# EAGLE schematic tunable_laser_controller (EAGLE 9.2.2)
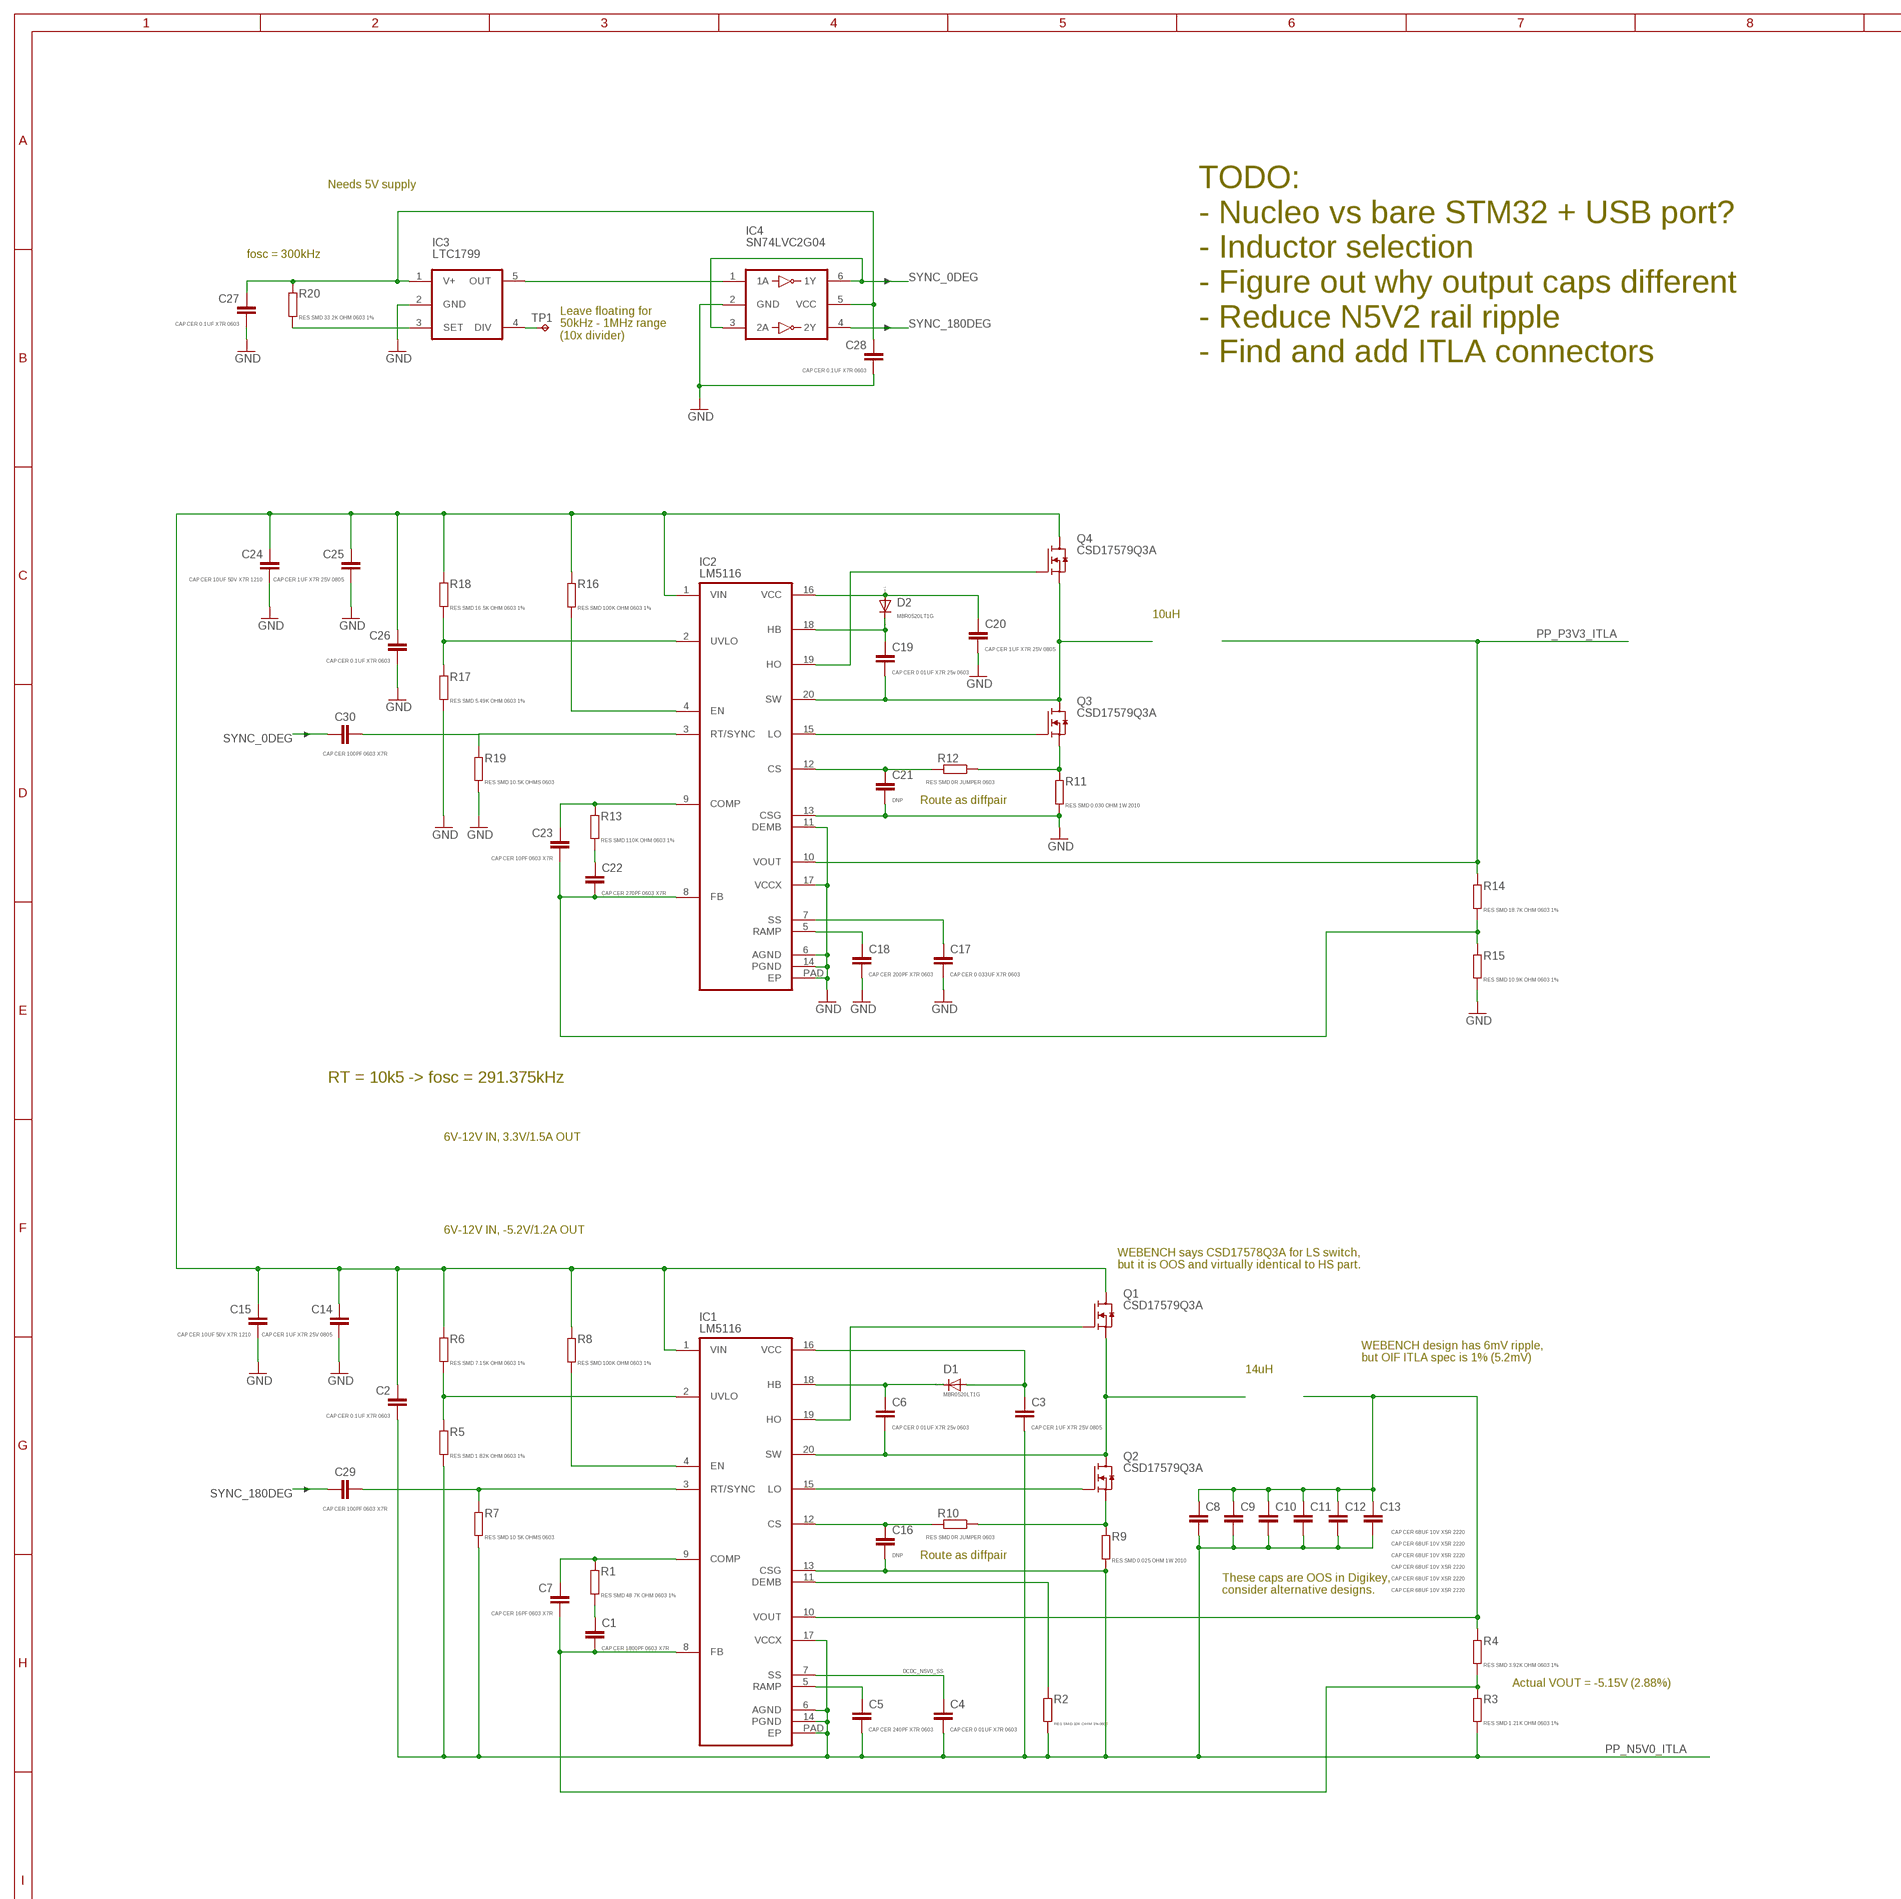
[diagram p0: schematic, sheet 1, part 1 of 2]
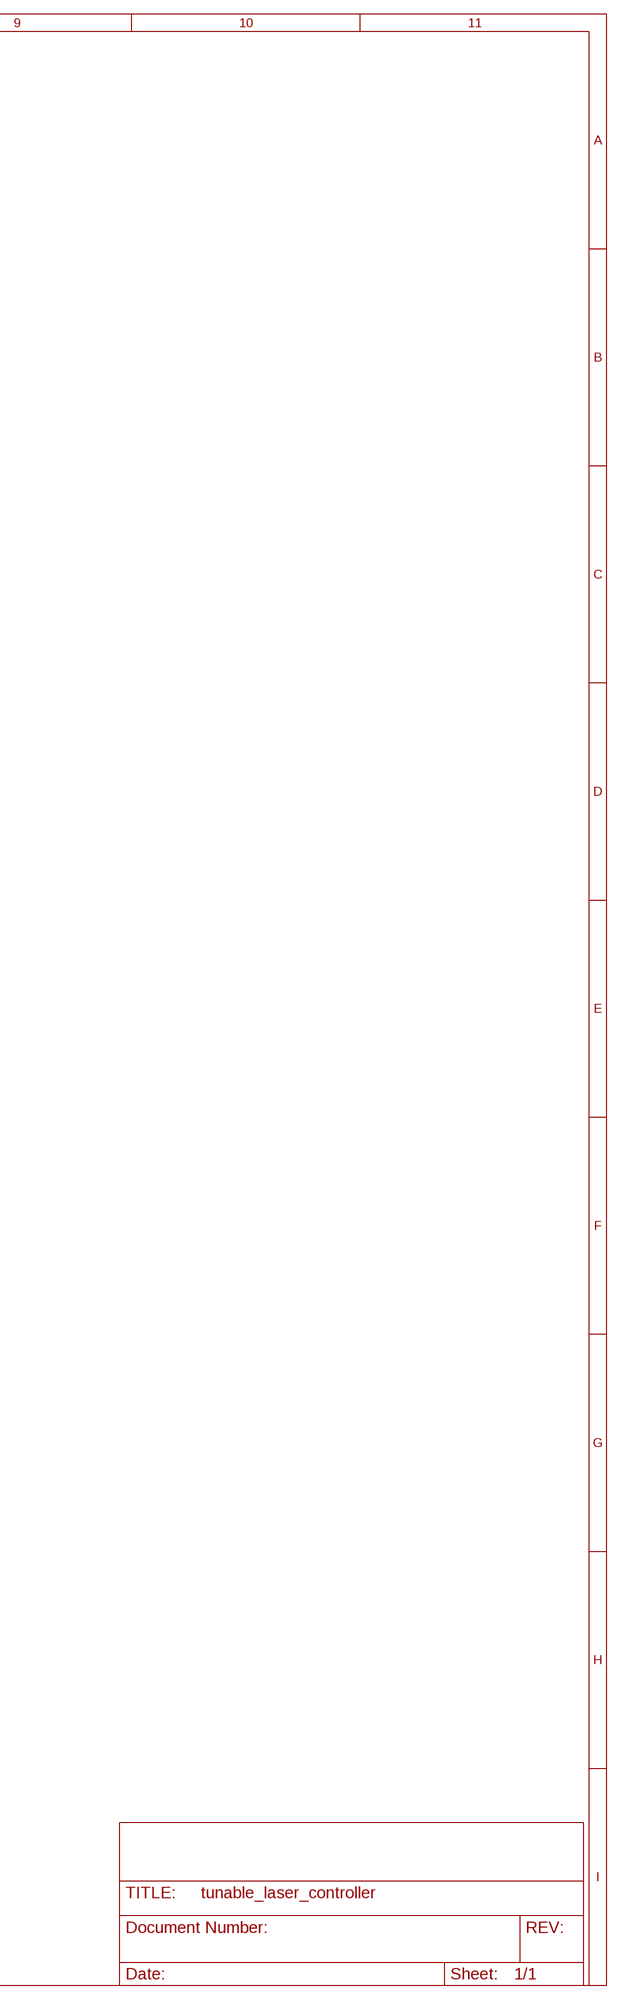
[diagram p1: schematic, sheet 1, part 2 of 2]

## Parts
C1  CAP CER 1800PF 0603 X7R  C-EUC0603  [C0603]
C2  CAP CER 0.1UF X7R 0603  C-EUC0603  [C0603]
C3  CAP CER 1UF X7R 25V 0805  C-EUC0805  [C0805]
C4  CAP CER 0.01UF X7R 0603  C-EUC0603  [C0603]
C5  CAP CER 240PF X7R 0603  C-EUC0603  [C0603]
C6  CAP CER 0.01UF X7R 25v 0603  C-EUC0603  [C0603]
C7  CAP CER 16PF 0603 X7R  C-EUC0603  [C0603]
C8  CAP CER 68UF 10V X5R 2220  C-EUC2220K  [C2220K]
C9  CAP CER 68UF 10V X5R 2220  C-EUC2220K  [C2220K]
C10  CAP CER 68UF 10V X5R 2220  C-EUC2220K  [C2220K]
C11  CAP CER 68UF 10V X5R 2220  C-EUC2220K  [C2220K]
C12  CAP CER 68UF 10V X5R 2220  C-EUC2220K  [C2220K]
C13  CAP CER 68UF 10V X5R 2220  C-EUC2220K  [C2220K]
C14  CAP CER 1UF X7R 25V 0805  C-EUC0805  [C0805]
C15  CAP CER 10UF 50V X7R 1210  C-EUC1210  [C1210]
C16  DNP  C-EUC0603  [C0603]
C17  CAP CER 0.033UF X7R 0603  C-EUC0603  [C0603]
C18  CAP CER 200PF X7R 0603  C-EUC0603  [C0603]
C19  CAP CER 0.01UF X7R 25v 0603  C-EUC0603  [C0603]
C20  CAP CER 1UF X7R 25V 0805  C-EUC0805  [C0805]
C21  DNP  C-EUC0603  [C0603]
C22  CAP CER 270PF 0603 X7R  C-EUC0603  [C0603]
C23  CAP CER 10PF 0603 X7R  C-EUC0603  [C0603]
C24  CAP CER 10UF 50V X7R 1210  C-EUC1210  [C1210]
C25  CAP CER 1UF X7R 25V 0805  C-EUC0805  [C0805]
C26  CAP CER 0.1UF X7R 0603  C-EUC0603  [C0603]
C27  CAP CER 0.1UF X7R 0603  C-EUC0603  [C0603]
C28  CAP CER 0.1UF X7R 0603  C-EUC0603  [C0603]
C29  CAP CER 100PF 0603 X7R  C-EUC0603  [C0603]
C30  CAP CER 100PF 0603 X7R  C-EUC0603  [C0603]
D1  MBR0520LT1G  CGRM4007-G  [SOD-123_MINI-SMA]
D2  MBR0520LT1G  CGRM4007-G  [SOD-123_MINI-SMA]
IC1  LM5116  [TSSOP20-PAD]
IC2  LM5116  [TSSOP20-PAD]
IC3  LTC1799  [SOT23-5L]
IC4  SN74LVC2G04  [SOT23-6L]
Q1  CSD17579Q3A  [8VSON]
Q2  CSD17579Q3A  [8VSON]
Q3  CSD17579Q3A  [8VSON]
Q4  CSD17579Q3A  [8VSON]
R1  RES SMD 48.7K OHM 0603 1%  R-EU_R0603  [R0603]
R2  RES SMD 10K OHM 1% 0603  R-EU_R0603  [R0603]
R3  RES SMD 1.21K OHM 0603 1%  R-EU_R0603  [R0603]
R4  RES SMD 3.92K OHM 0603 1%  R-EU_R0603  [R0603]
R5  RES SMD 1.82K OHM 0603 1%  R-EU_R0603  [R0603]
R6  RES SMD 7.15K OHM 0603 1%  R-EU_R0603  [R0603]
R7  RES SMD 10.5K OHMS 0603  R-EU_R0603  [R0603]
R8  RES SMD 100K OHM 0603 1%  R-EU_R0603  [R0603]
R9  RES SMD 0.025 OHM 1W 2010  R-EU_R1210  [R1210]
R10  RES SMD 0R JUMPER 0603  R-EU_R0603  [R0603]
R11  RES SMD 0.030 OHM 1W 2010  R-EU_R1210  [R1210]
R12  RES SMD 0R JUMPER 0603  R-EU_R0603  [R0603]
R13  RES SMD 110K OHM 0603 1%  R-EU_R0603  [R0603]
R14  RES SMD 18.7K OHM 0603 1%  R-EU_R0603  [R0603]
R15  RES SMD 10.9K OHM 0603 1%  R-EU_R0603  [R0603]
R16  RES SMD 100K OHM 0603 1%  R-EU_R0603  [R0603]
R17  RES SMD 5.49K OHM 0603 1%  R-EU_R0603  [R0603]
R18  RES SMD 16.5K OHM 0603 1%  R-EU_R0603  [R0603]
R19  RES SMD 10.5K OHMS 0603  R-EU_R0603  [R0603]
R20  RES SMD 33.2K OHM 0603 1%  R-EU_R0603  [R0603]
TP1  TPTP20R  [TP20R]

## Nets
DCDC_N5V0_SS: C4.1 IC1.7(SS)
GND: C14.2 C15.2 C17.2 C18.2 C20.2 C21.2 C24.2 C25.2 C26.2 C27.2 C28.2 IC2.6(AGND) IC2.11(DEMB) IC2.13(CSG) IC2.14(PGND) IC2.17(VCCX) IC2.PAD(EP) IC3.2(GND) IC4.2(GND) R11.1 R15.1 R17.1 R19.1
N$1: C1.1 R1.1
N$2: C7.1 IC1.9(COMP) R1.2
N$3: C1.2 C7.2 IC1.8(FB) R3.2 R4.1
N$4: IC1.2(UVLO) R5.2 R6.1
N$5: C5.1 IC1.5(RAMP)
N$6: IC1.4(EN) R8.2
N$7: IC1.11(DEMB) R2.2
N$8: C6.1 D1.C IC1.18(HB)
N$9: C6.2 IC1.20(SW) Q1.1(S) Q1.2(S) Q1.3(S) Q2.5(D) Q2.6(D) Q2.7(D) Q2.8(D) Q2.9(D) Q2.V1(D) Q2.V2(D) Q2.V3(D) Q2.V4(D) Q2.V5(D) Q2.V6(D)
N$10: C2.1 C14.1 C15.1 C24.1 C25.1 C26.1 IC1.1(VIN) IC2.1(VIN) Q1.5(D) Q1.6(D) Q1.7(D) Q1.8(D) Q1.9(D) Q1.V1(D) Q1.V2(D) Q1.V3(D) Q1.V4(D) Q1.V5(D) Q1.V6(D) Q4.5(D) Q4.6(D) Q4.7(D) Q4.8(D) Q4.9(D) Q4.V1(D) Q4.V2(D) Q4.V3(D) Q4.V4(D) Q4.V5(D) Q4.V6(D) R6.2 R8.1 R16.1 R18.2
N$11: C16.1 IC1.12(CS) R10.2
N$12: IC1.19(HO) Q1.4(G)
N$13: C19.1 D2.C IC2.18(HB)
N$14: IC1.15(LO) Q2.4(G)
N$15: C8.1 C9.1 C10.1 C11.1 C12.1 C13.1 IC1.10(VOUT) R4.2
N$16: C3.1 D1.A IC1.16(VCC)
N$17: C29.2 IC1.3(RT/SYNC) R7.2
N$18: Q2.1(S) Q2.2(S) Q2.3(S) R9.2 R10.1
N$19: C18.1 IC2.5(RAMP)
N$20: C17.1 IC2.7(SS)
N$21: IC2.15(LO) Q3.4(G)
N$22: C20.1 D2.A IC2.16(VCC)
N$23: C21.1 IC2.12(CS) R12.2
N$24: IC2.19(HO) Q4.4(G)
N$25: C19.2 IC2.20(SW) Q3.5(D) Q3.6(D) Q3.7(D) Q3.8(D) Q3.9(D) Q3.V1(D) Q3.V2(D) Q3.V3(D) Q3.V4(D) Q3.V5(D) Q3.V6(D) Q4.1(S) Q4.2(S) Q4.3(S)
N$26: Q3.1(S) Q3.2(S) Q3.3(S) R11.2 R12.1
N$27: C22.1 R13.1
N$29: C23.1 IC2.9(COMP) R13.2
N$30: C22.2 C23.2 IC2.8(FB) R14.1 R15.2
N$31: IC2.2(UVLO) R17.2 R18.1
N$32: C30.2 IC2.3(RT/SYNC) R19.2
N$33: IC3.3(SET) R20.2
N$34: IC2.4(EN) R16.2
N$35: IC3.4(DIV) TP1.TP
N$36: IC3.5(OUT) IC4.1(1A)
N$38: C27.1 C28.1 IC3.1(V+) IC4.5(VCC) R20.1
PP_N5V0_ITLA: C2.2 C3.2 C4.2 C5.2 C8.2 C9.2 C10.2 C11.2 C12.2 C13.2 C16.2 IC1.6(AGND) IC1.13(CSG) IC1.14(PGND) IC1.17(VCCX) IC1.PAD(EP) R2.1 R3.1 R5.1 R7.1 R9.1
PP_P3V3_ITLA: IC2.10(VOUT) R14.2
SYNC_0DEG: C30.1 IC4.3(2A) IC4.6(1Y)
SYNC_180DEG: C29.1 IC4.4(2Y)

## Notes on the sheet
- Needs 5V supply
- fosc = 300kHz
- Leave floating for
  50kHz - 1MHz range
  (10x divider)
- TODO:
  - Nucleo vs bare STM32 + USB port?
  - Inductor selection
  - Figure out why output caps different
  - Reduce N5V2 rail ripple
  - Find and add ITLA connectors
- 10uH
- Route as diffpair
- RT = 10k5 -> fosc = 291.375kHz
- 6V-12V IN, 3.3V/1.5A OUT
- 6V-12V IN, -5.2V/1.2A OUT
- WEBENCH says CSD17578Q3A for LS switch,
  but it is OOS and virtually identical to HS part.
- WEBENCH design has 6mV ripple,
  but OIF ITLA spec is 1% (5.2mV)
- 14uH
- Route as diffpair
- These caps are OOS in Digikey,
  consider alternative designs.
- Actual VOUT = -5.15V (2.88%)

## Library data of the parts
C1-C30 = rcl-modified-footprints:C-EU: CAPACITOR, European symbol
D1 D2 = diode:CGRM400*-G: Molded plasitc,JEDEC SOD-123/Mini SMA Source: Comchip CGRM4001-G.pdf
IC1 IC2 = newchips:LM5116: NS Wide Range Synchronous Buck Controller
IC3 = itla:LTC1799
IC4 = itla:SN74LVC2G04
Q1-Q4 = itla:CSD17579Q3A
R1-R20 = rcl-modified-footprints:R-EU_: RESISTOR, European symbol
TP1 = testpad:TP: Test pad